# Altium schematic sheet OSSI-1 Analog Temp Module.SchDoc: TITLE:
size 286 x 202 mm; Date: Date:; >LAST_DATE_TIME: 01/11/2015 12:46:21; Sheet:: Sheet:; >SHEET: 1; REV:: REV:; Document Number:: Document Number:; >DRAWING_NAME: OSSI-1 Analog Temp Module.sch
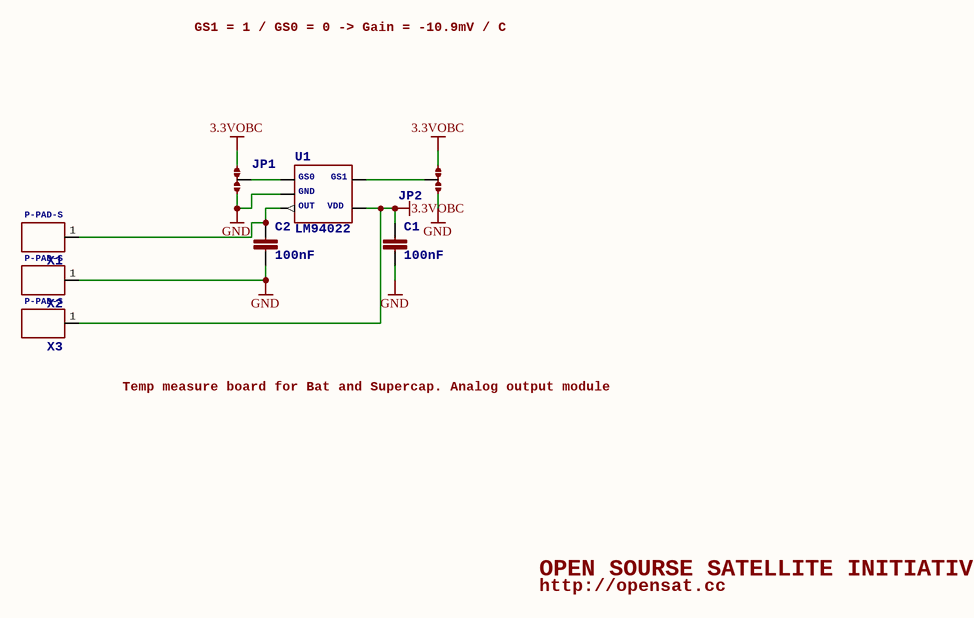
[diagram p0: OSSI-1 Analog Temp Module.SchDoc]

## Parts
C1  >NAME: C1  [C0603(1608)]  (hidden comment: 100nF)
C2  >NAME: C2  [C0603(1608)]  (hidden comment: 100nF)
JP1  >NAME: JP1  [JP2SMD0603]  (hidden comment: JP2)
JP2  JP2  [JP2SMD0603]
U1  >NAME: U1  [SC70-5]  (hidden comment: LM94022)
X1  >NAME: X1  [P-PAD-S]  (hidden comment: P-PAD-S)
X2  >NAME: X2  [P-PAD-S]  (hidden comment: P-PAD-S)
X3  >NAME: X3  [P-PAD-S]  (hidden comment: P-PAD-S)

## Nets
3.3VOBC: C1.1 JP1.1 JP2.3 U1.P$4 X3.1(P$1)
GND: C1.2 C2.2 JP1.3 JP2.1 U1.P$2 X2.1(P$1)
NetC2_1: C2.1 U1.P$3 X1.1(P$1)
NetJP1_2: JP1.2 U1.P$1
NetJP2_2: JP2.2 U1.P$5

## Notes on the sheet
- GS1 = 1 / GS0 = 0 -> Gain = -10.9mV / C
- Temp measure board for Bat and Supercap. Analog output module
- OPEN SOURSE SATELLITE INITIATIVE
- http://opensat.cc

## Library data of the parts
C1 C2 = C0603(1608): >VALUE: 100nF
U1 = LM94022: LM94022 Temp Sensor From TI; GS0: GS0; GND: GND; OUT: OUT; GS1: GS1; VDD: VDD; >VALUE: LM94022
JP1 JP2 = JP2
  JP2: >NAME: JP2
X1-X3 = P-PAD-S: >VALUE: P-PAD-S